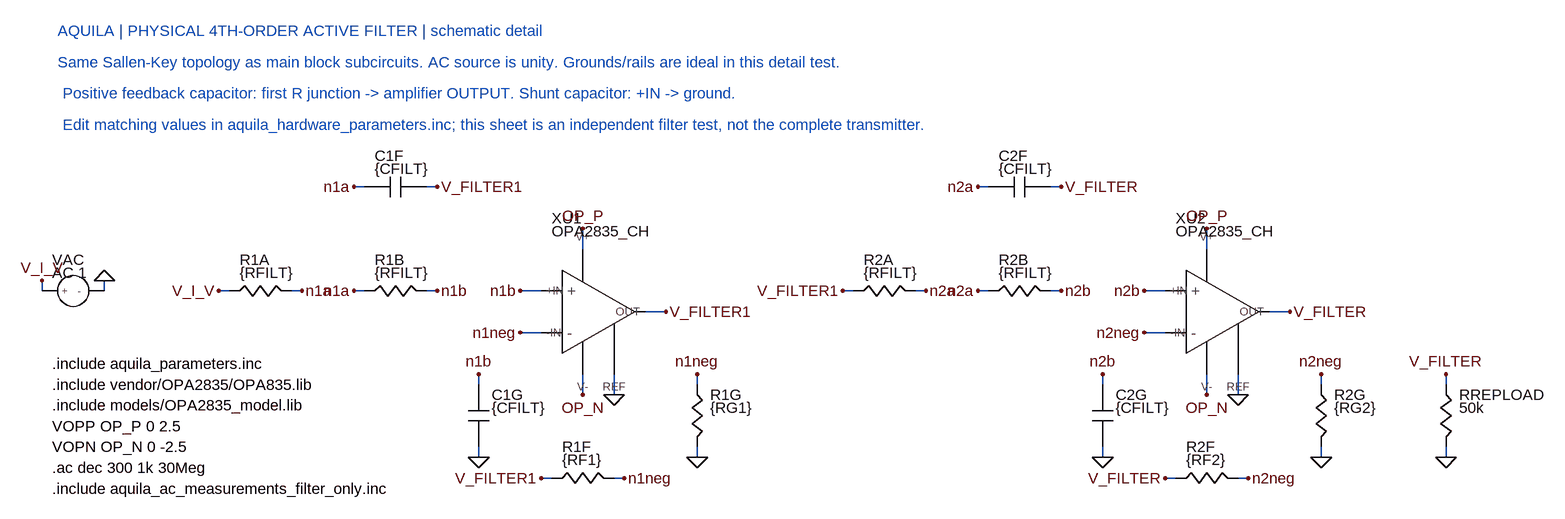
[diagram p0: schematic AQUILA_FILTER_DETAIL.asc]
AQUILA_FILTER_DETAIL.asc, the LTspice schematic file:
Version 4.1
SHEET 1 2432 1152
WIRE 528 128 512 128
WIRE 640 128 624 128
WIRE 1488 128 1472 128
WIRE 1600 128 1584 128
WIRE 864 224 864 192
WIRE 1824 224 1824 192
WIRE 32 288 32 272
WIRE 128 288 128 272
WIRE 320 288 304 288
WIRE 432 288 416 288
WIRE 528 288 512 288
WIRE 640 288 624 288
WIRE 800 288 768 288
WIRE 1280 288 1264 288
WIRE 1392 288 1376 288
WIRE 1488 288 1472 288
WIRE 1600 288 1584 288
WIRE 1760 288 1728 288
WIRE 992 320 960 320
WIRE 1952 320 1920 320
WIRE 800 352 768 352
WIRE 1760 352 1728 352
WIRE 704 432 704 416
WIRE 1040 432 1040 416
WIRE 1664 432 1664 416
WIRE 2000 432 2000 416
WIRE 2192 432 2192 416
WIRE 864 448 864 416
WIRE 912 448 912 416
WIRE 1824 448 1824 416
WIRE 1872 448 1872 416
WIRE 704 544 704 528
WIRE 1040 544 1040 528
WIRE 1664 544 1664 528
WIRE 2000 544 2000 528
WIRE 2192 544 2192 528
WIRE 816 576 800 576
WIRE 928 576 912 576
WIRE 1776 576 1760 576
WIRE 1888 576 1872 576
FLAG 32 272 V_I_V
FLAG 128 272 0
FLAG 304 288 V_I_V
FLAG 432 288 n1a
FLAG 512 288 n1a
FLAG 640 288 n1b
FLAG 512 128 n1a
FLAG 640 128 V_FILTER1
FLAG 704 416 n1b
FLAG 704 544 0
FLAG 768 288 n1b
FLAG 768 352 n1neg
FLAG 864 192 OP_P
FLAG 864 448 OP_N
FLAG 992 320 V_FILTER1
FLAG 912 448 0
FLAG 800 576 V_FILTER1
FLAG 928 576 n1neg
FLAG 1040 416 n1neg
FLAG 1040 544 0
FLAG 1264 288 V_FILTER1
FLAG 1392 288 n2a
FLAG 1472 288 n2a
FLAG 1600 288 n2b
FLAG 1472 128 n2a
FLAG 1600 128 V_FILTER
FLAG 1664 416 n2b
FLAG 1664 544 0
FLAG 1728 288 n2b
FLAG 1728 352 n2neg
FLAG 1824 192 OP_P
FLAG 1824 448 OP_N
FLAG 1952 320 V_FILTER
FLAG 1872 448 0
FLAG 1760 576 V_FILTER
FLAG 1888 576 n2neg
FLAG 2000 416 n2neg
FLAG 2000 544 0
FLAG 2192 416 V_FILTER
FLAG 2192 544 0
SYMBOL symbols\\AQ_V 32 288 R0
SYMATTR InstName VAC
SYMATTR Value AC 1
SYMBOL symbols\\AQ_R 320 288 R0
SYMATTR InstName R1A
SYMATTR Value {RFILT}
SYMBOL symbols\\AQ_R 528 288 R0
SYMATTR InstName R1B
SYMATTR Value {RFILT}
SYMBOL symbols\\AQ_C 528 128 R0
SYMATTR InstName C1F
SYMATTR Value {CFILT}
SYMBOL symbols\\AQ_CV 704 432 R0
SYMATTR InstName C1G
SYMATTR Value {CFILT}
SYMBOL symbols\\OPA2835 800 320 R0
SYMATTR InstName XU1
SYMBOL symbols\\AQ_R 816 576 R0
SYMATTR InstName R1F
SYMATTR Value {RF1}
SYMBOL symbols\\AQ_RV 1040 432 R0
SYMATTR InstName R1G
SYMATTR Value {RG1}
SYMBOL symbols\\AQ_R 1280 288 R0
SYMATTR InstName R2A
SYMATTR Value {RFILT}
SYMBOL symbols\\AQ_R 1488 288 R0
SYMATTR InstName R2B
SYMATTR Value {RFILT}
SYMBOL symbols\\AQ_C 1488 128 R0
SYMATTR InstName C2F
SYMATTR Value {CFILT}
SYMBOL symbols\\AQ_CV 1664 432 R0
SYMATTR InstName C2G
SYMATTR Value {CFILT}
SYMBOL symbols\\OPA2835 1760 320 R0
SYMATTR InstName XU2
SYMBOL symbols\\AQ_R 1776 576 R0
SYMATTR InstName R2F
SYMATTR Value {RF2}
SYMBOL symbols\\AQ_RV 2000 432 R0
SYMATTR InstName R2G
SYMATTR Value {RG2}
SYMBOL symbols\\AQ_RV 2192 432 R0
SYMATTR InstName RREPLOAD
SYMATTR Value 50k
TEXT 56 -112 Left 2 ;AQUILA | PHYSICAL 4TH-ORDER ACTIVE FILTER | schematic detail
TEXT 56 -64 Left 2 ;Same Sallen-Key topology as main block subcircuits. AC source is unity. Grounds/rails are ideal in this detail test.
TEXT 64 -16 Left 2 ;Positive feedback capacitor: first R junction -> amplifier OUTPUT. Shunt capacitor: +IN -> ground.
TEXT 64 32 Left 2 ;Edit matching values in aquila_hardware_parameters.inc; this sheet is an independent filter test, not the complete transmitter.
TEXT 48 400 Left 2 !.include aquila_parameters.inc
TEXT 48 432 Left 2 !.include vendor/OPA2835/OPA835.lib
TEXT 48 464 Left 2 !.include models/OPA2835_model.lib
TEXT 48 496 Left 2 !VOPP OP_P 0 2.5
TEXT 48 528 Left 2 !VOPN OP_N 0 -2.5
TEXT 48 560 Left 2 !.ac dec 300 1k 30Meg
TEXT 48 592 Left 2 !.include aquila_ac_measurements_filter_only.inc

The netlist it stands for:
* AQUILA_FILTER_DETAIL.asc
VAC V_I_V 0 AC 1
R1A V_I_V n1a {RFILT}
R1B n1a n1b {RFILT}
C1F n1a V_FILTER1 {CFILT}
C1G n1b 0 {CFILT}
X§XU1 n1b n1neg OP_P OP_N V_FILTER1 0 OPA2835_CH  ; pins +IN -IN V+ V- OUT REF
R1F V_FILTER1 n1neg {RF1}
R1G n1neg 0 {RG1}
R2A V_FILTER1 n2a {RFILT}
R2B n2a n2b {RFILT}
C2F n2a V_FILTER {CFILT}
C2G n2b 0 {CFILT}
X§XU2 n2b n2neg OP_P OP_N V_FILTER 0 OPA2835_CH  ; pins +IN -IN V+ V- OUT REF
R2F V_FILTER n2neg {RF2}
R2G n2neg 0 {RG2}
RREPLOAD V_FILTER 0 50k
* AQUILA | PHYSICAL 4TH-ORDER ACTIVE FILTER | schematic detail
* Same Sallen-Key topology as main block subcircuits. AC source is unity. Grounds/rails are ideal in this detail test.
* Positive feedback capacitor: first R junction -> amplifier OUTPUT. Shunt capacitor: +IN -> ground.
* Edit matching values in aquila_hardware_parameters.inc; this sheet is an independent filter test, not the complete transmitter.
.include aquila_parameters.inc
.include vendor/OPA2835/OPA835.lib
.include models/OPA2835_model.lib
VOPP OP_P 0 2.5
VOPN OP_N 0 -2.5
.ac dec 300 1k 30Meg
.include aquila_ac_measurements_filter_only.inc
.backanno
.end